# Altium project Pegasus.PrjPcb
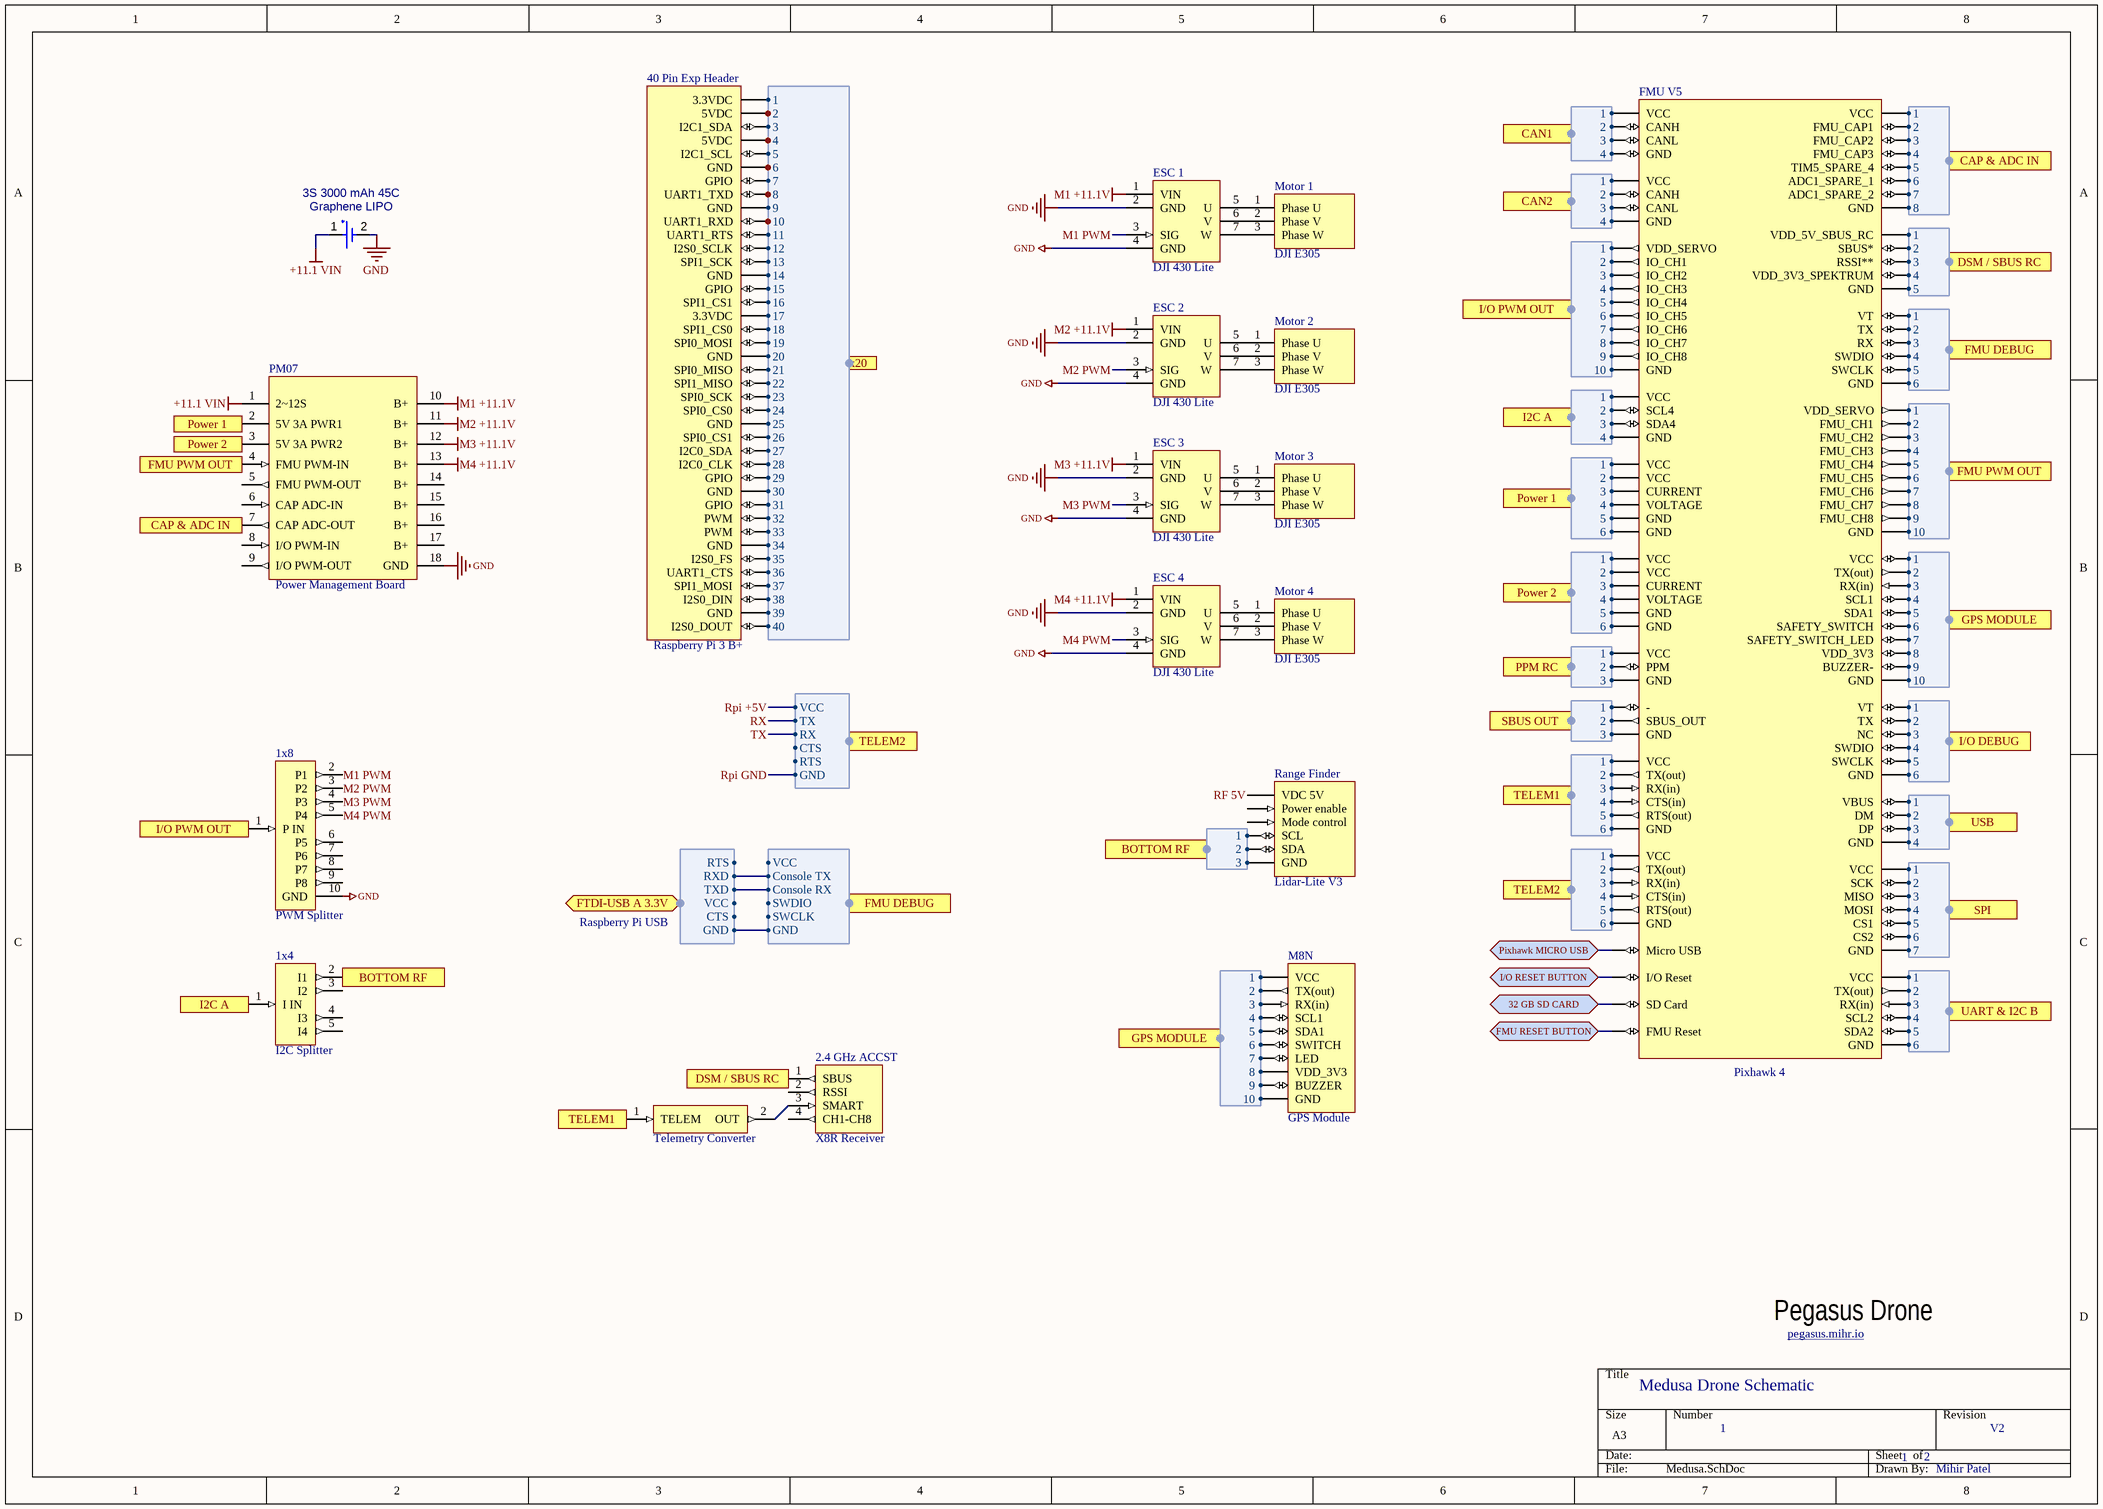
[diagram p0: Medusa.SchDoc]
3 sheets, 78 parts. Net scope: hierarchical (ports join the sheet entries above them; power ports are global).
Sheets:
  Medusa.SchDoc
  Pegasus.SchDoc
    Pegasus PCB = Bellerophon.SchDoc

## Sheet Medusa.SchDoc
size A3; SheetNumber: 1; SheetTotal: 3

### Parts
(Parts that share a designator on the sheet are numbered #1, #2 ... from top to bottom, then left to right.)
1x4#1  I2C Splitter
1x8#1  PWM Splitter
2.4_GHz_ACCST  X8R Receiver
3S_3000_mAh_45C  Graphene LIPO  [SEIK-MS621FE-FL11E-2_V]
40_Pin_Exp_Header  Raspberry Pi 3 B+
ESC_1#1  DJI 430 Lite
ESC_2#1  DJI 430 Lite
ESC_3#1  DJI 430 Lite
ESC_4#1  DJI 430 Lite
FMU_V5#1  Pixhawk 4
M8N#1  GPS Module
Motor_1#1  DJI E305
Motor_2#1  DJI E305
Motor_3#1  DJI E305
Motor_4#1  DJI E305
PM07#1  Power Management Board
Range_Finder  Lidar-Lite V3
TC?  Telemetry Converter

### Ports
2x20 (harness NX), 32 GB SD CARD (bidir), BOTTOM RF (harness *), BOTTOM RF (harness xx), CAN1 (harness CAN1), CAN2 (harness CAN2), CAP & ADC IN (harness CAP & ADC IN), DSM / SBUS RC (harness DSM / SBUS RC), FMU DEBUG (harness FDD), FMU DEBUG (harness FMU DEBUG), FMU PWM OUT (harness FMU PWM OUT), FMU RESET BUTTON (bidir), FTDI-USB A 3.3V (bidir, harness USBD), GPS MODULE (harness GPS MODULE), GPS MODULE (harness GPS), I2C A (harness I2C A), I/O DEBUG (harness IO DEBUG), I/O PWM OUT (harness I/O PWM OUT), I/O RESET BUTTON (bidir), Pixhawk MICRO USB (bidir), Power 1 (harness Power 1), Power 2 (harness Power 2), PPM RC (harness PPM RC), SBUS OUT (harness SBUS OUT), SPI (harness SPI), TELEM1 (harness TELEM1), TELEM2 (harness TELEM2), TELEM2 (harness X1), UART & I2C B (harness UART & I2C B), USB (harness USB)

### Harnesses
CAP & ADC IN: 1, 2, 3, 4, 5, 6, 7, 8
DSM / SBUS RC: 1, 2, 3, 4, 5
FMU DEBUG: 1, 2, 3, 4, 5, 6
FMU PWM OUT: 1, 2, 3, 4, 5, 6, 7, 8, 9, 10
IO DEBUG: 1, 2, 3, 4, 5, 6
SPI: 1, 2, 3, 4, 5, 6, 7
CAN1: 1, 2, 3, 4
CAN2: 1, 2, 3, 4
I/O PWM OUT: 1, 2, 3, 4, 5, 6, 7, 8, 9, 10
I2C A: 1, 2, 3, 4
Power 1: 1, 2, 3, 4, 5, 6
Power 2: 1, 2, 3, 4, 5, 6
SBUS OUT: 1, 2, 3
TELEM1: 1, 2, 3, 4, 5, 6
TELEM2: 1, 2, 3, 4, 5, 6
GPS MODULE: 1, 2, 3, 4, 5, 6, 7, 8, 9, 10
PPM RC: 1, 2, 3
USB: 1, 2, 3, 4
UART & I2C B: 1, 2, 3, 4, 5, 6
GPS: 1, 2, 3, 4, 5, 6, 7, 8, 9, 10
NX: 1, 2, 3, 4, 5, 6, 7, 8, 9, 10, 11, 12, 13, 14, 15, 16, 17, 18, 19, 20, 21, 22, 23, 24, 25, 26, 27, 28, 29, 30, 31, 32, 33, 34, 35, 36, 37, 38, 39, 40
FDD: VCC, Console TX, Console RX, SWDIO, SWCLK, GND
USBD: GND, CTS, VCC, TXD, RXD, RTS
xx: 1, 2, 3
X1: VCC, TX, RX, CTS, RTS, GND

### Nets
+11.1 VIN: 3S_3000_mAh_45C.1(+) PM07#1.1(2~12S)
GND: 1x8#1.10(GND) 3S_3000_mAh_45C.2(-) ESC_1#1.2(GND) ESC_1#1.4(GND) ESC_2#1.2(GND) ESC_2#1.4(GND) ESC_3#1.2(GND) ESC_3#1.4(GND) ESC_4#1.2(GND) ESC_4#1.4(GND) PM07#1.18(GND)
M1 +11.1V: ESC_1#1.1(VIN) PM07#1.10(B+)
M2 +11.1V: ESC_2#1.1(VIN) PM07#1.11(B+)
M3 +11.1V: ESC_3#1.1(VIN) PM07#1.12(B+)
M4 +11.1V: ESC_4#1.1(VIN) PM07#1.13(B+)
M1 PWM: 1x8#1.2(P1) ESC_1#1.3(SIG)
M2 PWM: 1x8#1.3(P2) ESC_2#1.3(SIG)
M3 PWM: 1x8#1.4(P3) ESC_3#1.3(SIG)
M4 PWM: 1x8#1.5(P4) ESC_4#1.3(SIG)
RF 5V: 40_Pin_Exp_Header.2(5VDC) Range_Finder.1(VDC_5V) ; harness NX.2
Rpi +5V: 40_Pin_Exp_Header.4(5VDC) ; harness NX.4, port TELEM2.VCC
Rpi GND: 40_Pin_Exp_Header.6(GND) ; harness NX.6, port TELEM2.GND
RX: 40_Pin_Exp_Header.10(UART1_RXD) ; harness NX.10, port TELEM2.TX
TX: 40_Pin_Exp_Header.8(UART1_TXD) ; harness NX.8, port TELEM2.RX
Net2.4_GHz_ACCST_3: 2.4_GHz_ACCST.3(SMART) TC?.2(OUT)
Net40_Pin_Exp_Header_1: 40_Pin_Exp_Header.1(3.3VDC) ; harness NX.1
Net40_Pin_Exp_Header_3: 40_Pin_Exp_Header.3(I2C1_SDA) ; harness NX.3
Net40_Pin_Exp_Header_5: 40_Pin_Exp_Header.5(I2C1_SCL) ; harness NX.5
Net40_Pin_Exp_Header_7: 40_Pin_Exp_Header.7(GPIO) ; harness NX.7
Net40_Pin_Exp_Header_9: 40_Pin_Exp_Header.9(GND) ; harness NX.9
Net40_Pin_Exp_Header_11: 40_Pin_Exp_Header.11(UART1_RTS) ; harness NX.11
Net40_Pin_Exp_Header_12: 40_Pin_Exp_Header.12(I2S0_SCLK) ; harness NX.12
Net40_Pin_Exp_Header_13: 40_Pin_Exp_Header.13(SPI1_SCK) ; harness NX.13
Net40_Pin_Exp_Header_14: 40_Pin_Exp_Header.14(GND) ; harness NX.14
Net40_Pin_Exp_Header_15: 40_Pin_Exp_Header.15(GPIO) ; harness NX.15
Net40_Pin_Exp_Header_16: 40_Pin_Exp_Header.16(SPI1_CS1) ; harness NX.16
Net40_Pin_Exp_Header_17: 40_Pin_Exp_Header.17(3.3VDC) ; harness NX.17
Net40_Pin_Exp_Header_18: 40_Pin_Exp_Header.18(SPI1_CS0) ; harness NX.18
Net40_Pin_Exp_Header_19: 40_Pin_Exp_Header.19(SPI0_MOSI) ; harness NX.19
Net40_Pin_Exp_Header_20: 40_Pin_Exp_Header.20(GND) ; harness NX.20
Net40_Pin_Exp_Header_21: 40_Pin_Exp_Header.21(SPI0_MISO) ; harness NX.21
Net40_Pin_Exp_Header_22: 40_Pin_Exp_Header.22(SPI1_MISO) ; harness NX.22
Net40_Pin_Exp_Header_23: 40_Pin_Exp_Header.23(SPI0_SCK) ; harness NX.23
Net40_Pin_Exp_Header_24: 40_Pin_Exp_Header.24(SPI0_CS0) ; harness NX.24
Net40_Pin_Exp_Header_25: 40_Pin_Exp_Header.25(GND) ; harness NX.25
Net40_Pin_Exp_Header_26: 40_Pin_Exp_Header.26(SPI0_CS1) ; harness NX.26
Net40_Pin_Exp_Header_27: 40_Pin_Exp_Header.27(I2C0_SDA) ; harness NX.27
Net40_Pin_Exp_Header_28: 40_Pin_Exp_Header.28(I2C0_CLK) ; harness NX.28
Net40_Pin_Exp_Header_29: 40_Pin_Exp_Header.29(GPIO) ; harness NX.29
Net40_Pin_Exp_Header_30: 40_Pin_Exp_Header.30(GND) ; harness NX.30
Net40_Pin_Exp_Header_31: 40_Pin_Exp_Header.31(GPIO) ; harness NX.31
Net40_Pin_Exp_Header_32: 40_Pin_Exp_Header.32(PWM) ; harness NX.32
Net40_Pin_Exp_Header_33: 40_Pin_Exp_Header.33(PWM) ; harness NX.33
Net40_Pin_Exp_Header_34: 40_Pin_Exp_Header.34(GND) ; harness NX.34
Net40_Pin_Exp_Header_35: 40_Pin_Exp_Header.35(I2S0_FS) ; harness NX.35
Net40_Pin_Exp_Header_36: 40_Pin_Exp_Header.36(UART1_CTS) ; harness NX.36
Net40_Pin_Exp_Header_37: 40_Pin_Exp_Header.37(SPI1_MOSI) ; harness NX.37
Net40_Pin_Exp_Header_38: 40_Pin_Exp_Header.38(I2S0_DIN) ; harness NX.38
Net40_Pin_Exp_Header_39: 40_Pin_Exp_Header.39(GND) ; harness NX.39
Net40_Pin_Exp_Header_40: 40_Pin_Exp_Header.40(I2S0_DOUT) ; harness NX.40
NetESC_1#1_5: ESC_1#1.5(U) Motor_1#1.1(Phase_U)
NetESC_1#1_6: ESC_1#1.6(V) Motor_1#1.2(Phase_V)
NetESC_1#1_7: ESC_1#1.7(W) Motor_1#1.3(Phase_W)
NetESC_2#1_5: ESC_2#1.5(U) Motor_2#1.1(Phase_U)
NetESC_2#1_6: ESC_2#1.6(V) Motor_2#1.2(Phase_V)
NetESC_2#1_7: ESC_2#1.7(W) Motor_2#1.3(Phase_W)
NetESC_3#1_5: ESC_3#1.5(U) Motor_3#1.1(Phase_U)
NetESC_3#1_6: ESC_3#1.6(V) Motor_3#1.2(Phase_V)
NetESC_3#1_7: ESC_3#1.7(W) Motor_3#1.3(Phase_W)
NetESC_4#1_5: ESC_4#1.5(U) Motor_4#1.1(Phase_U)
NetESC_4#1_6: ESC_4#1.6(V) Motor_4#1.2(Phase_V)
NetESC_4#1_7: ESC_4#1.7(W) Motor_4#1.3(Phase_W)
NetFMU_V5#1_1: FMU_V5#1.1(VCC) ; port Power 1.1
NetFMU_V5#1_2: FMU_V5#1.2(VCC) ; port Power 1.2
NetFMU_V5#1_3: FMU_V5#1.3(CURRENT) ; port Power 1.3
NetFMU_V5#1_4: FMU_V5#1.4(VOLTAGE) ; port Power 1.4
NetFMU_V5#1_5: FMU_V5#1.5(GND) ; port Power 1.5
NetFMU_V5#1_6: FMU_V5#1.6(GND) ; port Power 1.6
NetFMU_V5#1_7: FMU_V5#1.7(VCC) ; port Power 2.1
NetFMU_V5#1_8: FMU_V5#1.8(VCC) ; port Power 2.2
NetFMU_V5#1_9: FMU_V5#1.9(CURRENT) ; port Power 2.3
NetFMU_V5#1_10: FMU_V5#1.10(VOLTAGE) ; port Power 2.4
NetFMU_V5#1_11: FMU_V5#1.11(GND) ; port Power 2.5
NetFMU_V5#1_12: FMU_V5#1.12(GND) ; port Power 2.6
NetFMU_V5#1_13: FMU_V5#1.13(VCC) ; port TELEM1.1
NetFMU_V5#1_14: FMU_V5#1.14(TX(out)) ; port TELEM1.2
NetFMU_V5#1_15: FMU_V5#1.15(RX(in)) ; port TELEM1.3
NetFMU_V5#1_16: FMU_V5#1.16(CTS(in)) ; port TELEM1.4
NetFMU_V5#1_17: FMU_V5#1.17(RTS(out)) ; port TELEM1.5
NetFMU_V5#1_18: FMU_V5#1.18(GND) ; port TELEM1.6
NetFMU_V5#1_19: FMU_V5#1.19(VBUS) ; port USB.1
NetFMU_V5#1_20: FMU_V5#1.20(DM) ; port USB.2
NetFMU_V5#1_21: FMU_V5#1.21(DP) ; port USB.3
NetFMU_V5#1_22: FMU_V5#1.22(GND) ; port USB.4
NetFMU_V5#1_23: FMU_V5#1.23(VCC) ; port TELEM2.1
NetFMU_V5#1_24: FMU_V5#1.24(TX(out)) ; port TELEM2.2
NetFMU_V5#1_25: FMU_V5#1.25(RX(in)) ; port TELEM2.3
NetFMU_V5#1_26: FMU_V5#1.26(CTS(in)) ; port TELEM2.4
NetFMU_V5#1_27: FMU_V5#1.27(RTS(out)) ; port TELEM2.5
NetFMU_V5#1_28: FMU_V5#1.28(GND) ; port TELEM2.6
NetFMU_V5#1_29: FMU_V5#1.29(VCC) ; port CAN1.1
NetFMU_V5#1_30: FMU_V5#1.30(CANH) ; port CAN1.2
NetFMU_V5#1_31: FMU_V5#1.31(CANL) ; port CAN1.3
NetFMU_V5#1_32: FMU_V5#1.32(GND) ; port CAN1.4
NetFMU_V5#1_33: FMU_V5#1.33(VCC) ; port I2C A.1
NetFMU_V5#1_34: FMU_V5#1.34(SCL4) ; port I2C A.2
NetFMU_V5#1_35: FMU_V5#1.35(SDA4) ; port I2C A.3
NetFMU_V5#1_36: FMU_V5#1.36(GND) ; port I2C A.4
NetFMU_V5#1_37: FMU_V5#1.37(VCC) ; port CAN2.1
NetFMU_V5#1_38: FMU_V5#1.38(CANH) ; port CAN2.2
NetFMU_V5#1_39: FMU_V5#1.39(CANL) ; port CAN2.3
NetFMU_V5#1_40: FMU_V5#1.40(GND) ; port CAN2.4
NetFMU_V5#1_41: FMU_V5#1.41(-) ; port SBUS OUT.1
NetFMU_V5#1_42: FMU_V5#1.42(SBUS_OUT) ; port SBUS OUT.2
NetFMU_V5#1_43: FMU_V5#1.43(GND) ; port SBUS OUT.3
NetFMU_V5#1_44: FMU_V5#1.44(VCC) ; port PPM RC.1
NetFMU_V5#1_45: FMU_V5#1.45(PPM) ; port PPM RC.2
NetFMU_V5#1_46: FMU_V5#1.46(GND) ; port PPM RC.3
NetFMU_V5#1_47: FMU_V5#1.47(VDD_SERVO) ; port I/O PWM OUT.1
NetFMU_V5#1_48: FMU_V5#1.48(IO_CH1) ; port I/O PWM OUT.2
NetFMU_V5#1_49: FMU_V5#1.49(IO_CH2) ; port I/O PWM OUT.3
NetFMU_V5#1_50: FMU_V5#1.50(IO_CH3) ; port I/O PWM OUT.4
NetFMU_V5#1_51: FMU_V5#1.51(IO_CH4) ; port I/O PWM OUT.5
NetFMU_V5#1_52: FMU_V5#1.52(IO_CH5) ; port I/O PWM OUT.6
NetFMU_V5#1_53: FMU_V5#1.53(IO_CH6) ; port I/O PWM OUT.7
NetFMU_V5#1_54: FMU_V5#1.54(IO_CH7) ; port I/O PWM OUT.8
NetFMU_V5#1_55: FMU_V5#1.55(IO_CH8) ; port I/O PWM OUT.9
NetFMU_V5#1_56: FMU_V5#1.56(GND) ; port I/O PWM OUT.10
NetFMU_V5#1_57: FMU_V5#1.57(VCC) ; port UART & I2C B.1
NetFMU_V5#1_58: FMU_V5#1.58(TX(out)) ; port UART & I2C B.2
NetFMU_V5#1_59: FMU_V5#1.59(RX(in)) ; port UART & I2C B.3
NetFMU_V5#1_60: FMU_V5#1.60(SCL2) ; port UART & I2C B.4
NetFMU_V5#1_61: FMU_V5#1.61(SDA2) ; port UART & I2C B.5
NetFMU_V5#1_62: FMU_V5#1.62(GND) ; port UART & I2C B.6
NetFMU_V5#1_63: FMU_V5#1.63(VDD_5V_SBUS_RC) ; port DSM / SBUS RC.1
NetFMU_V5#1_64: FMU_V5#1.64(SBUS*) ; port DSM / SBUS RC.2
NetFMU_V5#1_65: FMU_V5#1.65(RSSI**) ; port DSM / SBUS RC.3
NetFMU_V5#1_66: FMU_V5#1.66(VDD_3V3_SPEKTRUM) ; port DSM / SBUS RC.4
NetFMU_V5#1_67: FMU_V5#1.67(GND) ; port DSM / SBUS RC.5
NetFMU_V5#1_68: FMU_V5#1.68(VCC) ; port CAP & ADC IN.1
NetFMU_V5#1_69: FMU_V5#1.69(FMU_CAP1) ; port CAP & ADC IN.2
NetFMU_V5#1_70: FMU_V5#1.70(FMU_CAP2) ; port CAP & ADC IN.3
NetFMU_V5#1_71: FMU_V5#1.71(FMU_CAP3) ; port CAP & ADC IN.4
NetFMU_V5#1_72: FMU_V5#1.72(TIM5_SPARE_4) ; port CAP & ADC IN.5
NetFMU_V5#1_73: FMU_V5#1.73(ADC1_SPARE_1) ; port CAP & ADC IN.6
NetFMU_V5#1_74: FMU_V5#1.74(ADC1_SPARE_2) ; port CAP & ADC IN.7
NetFMU_V5#1_75: FMU_V5#1.75(GND) ; port CAP & ADC IN.8
NetFMU_V5#1_76: FMU_V5#1.76(VCC) M8N#1.1(VCC) ; port GPS MODULE.1
NetFMU_V5#1_77: FMU_V5#1.77(TX(out)) M8N#1.2(TX(out)) ; port GPS MODULE.2
NetFMU_V5#1_78: FMU_V5#1.78(RX(in)) M8N#1.3(RX(in)) ; port GPS MODULE.3
NetFMU_V5#1_79: FMU_V5#1.79(SCL1) M8N#1.4(SCL1) ; port GPS MODULE.4
NetFMU_V5#1_80: FMU_V5#1.80(SDA1) M8N#1.5(SDA1) ; port GPS MODULE.5
NetFMU_V5#1_81: FMU_V5#1.81(SAFETY_SWITCH) M8N#1.6(SWITCH) ; port GPS MODULE.6
NetFMU_V5#1_82: FMU_V5#1.82(SAFETY_SWITCH_LED) M8N#1.7(LED) ; port GPS MODULE.7
NetFMU_V5#1_83: FMU_V5#1.83(VDD_3V3) M8N#1.8(VDD_3V3) ; port GPS MODULE.8
NetFMU_V5#1_84: FMU_V5#1.84(BUZZER-) M8N#1.9(BUZZER) ; port GPS MODULE.9
NetFMU_V5#1_85: FMU_V5#1.85(GND) M8N#1.10(GND) ; port GPS MODULE.10
NetFMU_V5#1_86: FMU_V5#1.86(VCC) ; port SPI.1
NetFMU_V5#1_87: FMU_V5#1.87(SCK) ; port SPI.2
NetFMU_V5#1_88: FMU_V5#1.88(MISO) ; port SPI.3
NetFMU_V5#1_89: FMU_V5#1.89(MOSI) ; port SPI.4
NetFMU_V5#1_90: FMU_V5#1.90(CS1) ; port SPI.5
NetFMU_V5#1_91: FMU_V5#1.91(CS2) ; port SPI.6
NetFMU_V5#1_92: FMU_V5#1.92(GND) ; port SPI.7
NetFMU_V5#1_93: FMU_V5#1.93(VDD_SERVO) ; port FMU PWM OUT.1
NetFMU_V5#1_94: FMU_V5#1.94(FMU_CH1) ; port FMU PWM OUT.2
NetFMU_V5#1_95: FMU_V5#1.95(FMU_CH2) ; port FMU PWM OUT.3
NetFMU_V5#1_96: FMU_V5#1.96(FMU_CH3) ; port FMU PWM OUT.4
NetFMU_V5#1_97: FMU_V5#1.97(FMU_CH4) ; port FMU PWM OUT.5
NetFMU_V5#1_98: FMU_V5#1.98(FMU_CH5) ; port FMU PWM OUT.6
NetFMU_V5#1_99: FMU_V5#1.99(FMU_CH6) ; port FMU PWM OUT.7
NetFMU_V5#1_100: FMU_V5#1.100(FMU_CH7) ; port FMU PWM OUT.8
NetFMU_V5#1_101: FMU_V5#1.101(FMU_CH8) ; port FMU PWM OUT.9
NetFMU_V5#1_102: FMU_V5#1.102(GND) ; port FMU PWM OUT.10
NetFMU_V5#1_103: FMU_V5#1.103(VT) ; port FMU DEBUG.1
NetFMU_V5#1_104: FMU_V5#1.104(TX) ; port FMU DEBUG.2
NetFMU_V5#1_105: FMU_V5#1.105(RX) ; port FMU DEBUG.3
NetFMU_V5#1_106: FMU_V5#1.106(SWDIO) ; port FMU DEBUG.4
NetFMU_V5#1_107: FMU_V5#1.107(SWCLK) ; port FMU DEBUG.5
NetFMU_V5#1_108: FMU_V5#1.108(GND) ; port FMU DEBUG.6
NetFMU_V5#1_109: FMU_V5#1.109(VT) ; port I/O DEBUG.1
NetFMU_V5#1_110: FMU_V5#1.110(TX) ; port I/O DEBUG.2
NetFMU_V5#1_111: FMU_V5#1.111(NC) ; port I/O DEBUG.3
NetFMU_V5#1_112: FMU_V5#1.112(SWDIO) ; port I/O DEBUG.4
NetFMU_V5#1_113: FMU_V5#1.113(SWCLK) ; port I/O DEBUG.5
NetFMU_V5#1_114: FMU_V5#1.114(GND) ; port I/O DEBUG.6
NetFMU_V5#1_115: FMU_V5#1.115(Micro_USB) ; port Pixhawk MICRO USB
NetFMU_V5#1_116: FMU_V5#1.116(I/O_Reset) ; port I/O RESET BUTTON
NetFMU_V5#1_117: FMU_V5#1.117(SD_Card) ; port 32 GB SD CARD
NetFMU_V5#1_118: FMU_V5#1.118(FMU_Reset) ; port FMU RESET BUTTON
NetRange_Finder_4: Range_Finder.4(SCL) ; port BOTTOM RF.1
NetRange_Finder_5: Range_Finder.5(SDA) ; port BOTTOM RF.2
NetRange_Finder_6: Range_Finder.6(GND) ; port BOTTOM RF.3
(unnamed): port FMU DEBUG.Console TX, port FTDI-USB A 3.3V.RXD
(unnamed): port FMU DEBUG.Console RX, port FTDI-USB A 3.3V.TXD
(unnamed): port FMU DEBUG.GND, port FTDI-USB A 3.3V.GND

Not connected (* = marked no-connect by the designer): 1x4#1 1(I_IN) 2(I1) 3(I2) 4(I3) 5(I4); 1x8#1 1(P_IN) 6(P5) 7(P6) 8(P7) 9(P8); 2.4_GHz_ACCST 1(SBUS) 2(RSSI) 4(CH1-CH8); PM07#1 2(5V_3A_PWR1) 3(5V_3A_PWR2) 4(FMU_PWM-IN) 5(FMU_PWM-OUT) 6(CAP_ADC-IN) 7(CAP_ADC-OUT) 8(I/O_PWM-IN) 9(I/O_PWM-OUT) 14(B+) 15(B+) 16(B+) 17(B+); Range_Finder 2(Power_enable) 3(Mode_control); TC? 1(TELEM)

### Notes on the sheet
- Raspberry Pi USB
- Pegasus Drone
- Medusa Drone Schematic
- pegasus.mihr.io <http://pegasus.mihr.io>
- 1
- 2
- V2
- Mihir Patel

### Library data of the parts
1x4#1 = CMP-00028-00024-3: Holybro I2C Splitter
1x8#1 = CMP-00028-00022-4: Holybro PWM Splitter
2.4_GHz_ACCST = CMP-00028-00023-1: FrSky 2.4GHz ACCST
3S_3000_mAh_45C = CMP-00029-00000-1: MS Lihium Rechargeable Battery, 3 V, -20 to 60 degC, Tray; RoHS Compliant: NotApplicable; Mounting Technology: WithLeads; Pins: 2
40_Pin_Exp_Header = CMP-00028-00030-3: 40 Pin Exp Header
ESC_1#1 ESC_2#1 ESC_3#1 ESC_4#1 = CMP-00028-00016-7: T-Motor ESC 600 Hz
FMU_V5#1 = CMP-00028-00018-8: FMU V5
M8N#1 = CMP-00028-00021-1: Pixhawk 4 GPS Module
Motor_1#1 Motor_2#1 Motor_3#1 Motor_4#1 = CMP-00028-00017-4: KV400
PM07#1 = CMP-00028-00007-5: Holybro Power Module
Range_Finder = CMP-00028-00011-7: Garmin Lidar
TC? = CMP-00028-00026-1: FrSky Yappu Telemetry Converter Cable

## Sheet Pegasus.SchDoc
size Tabloid; SheetNumber: 2; SheetTotal: 3
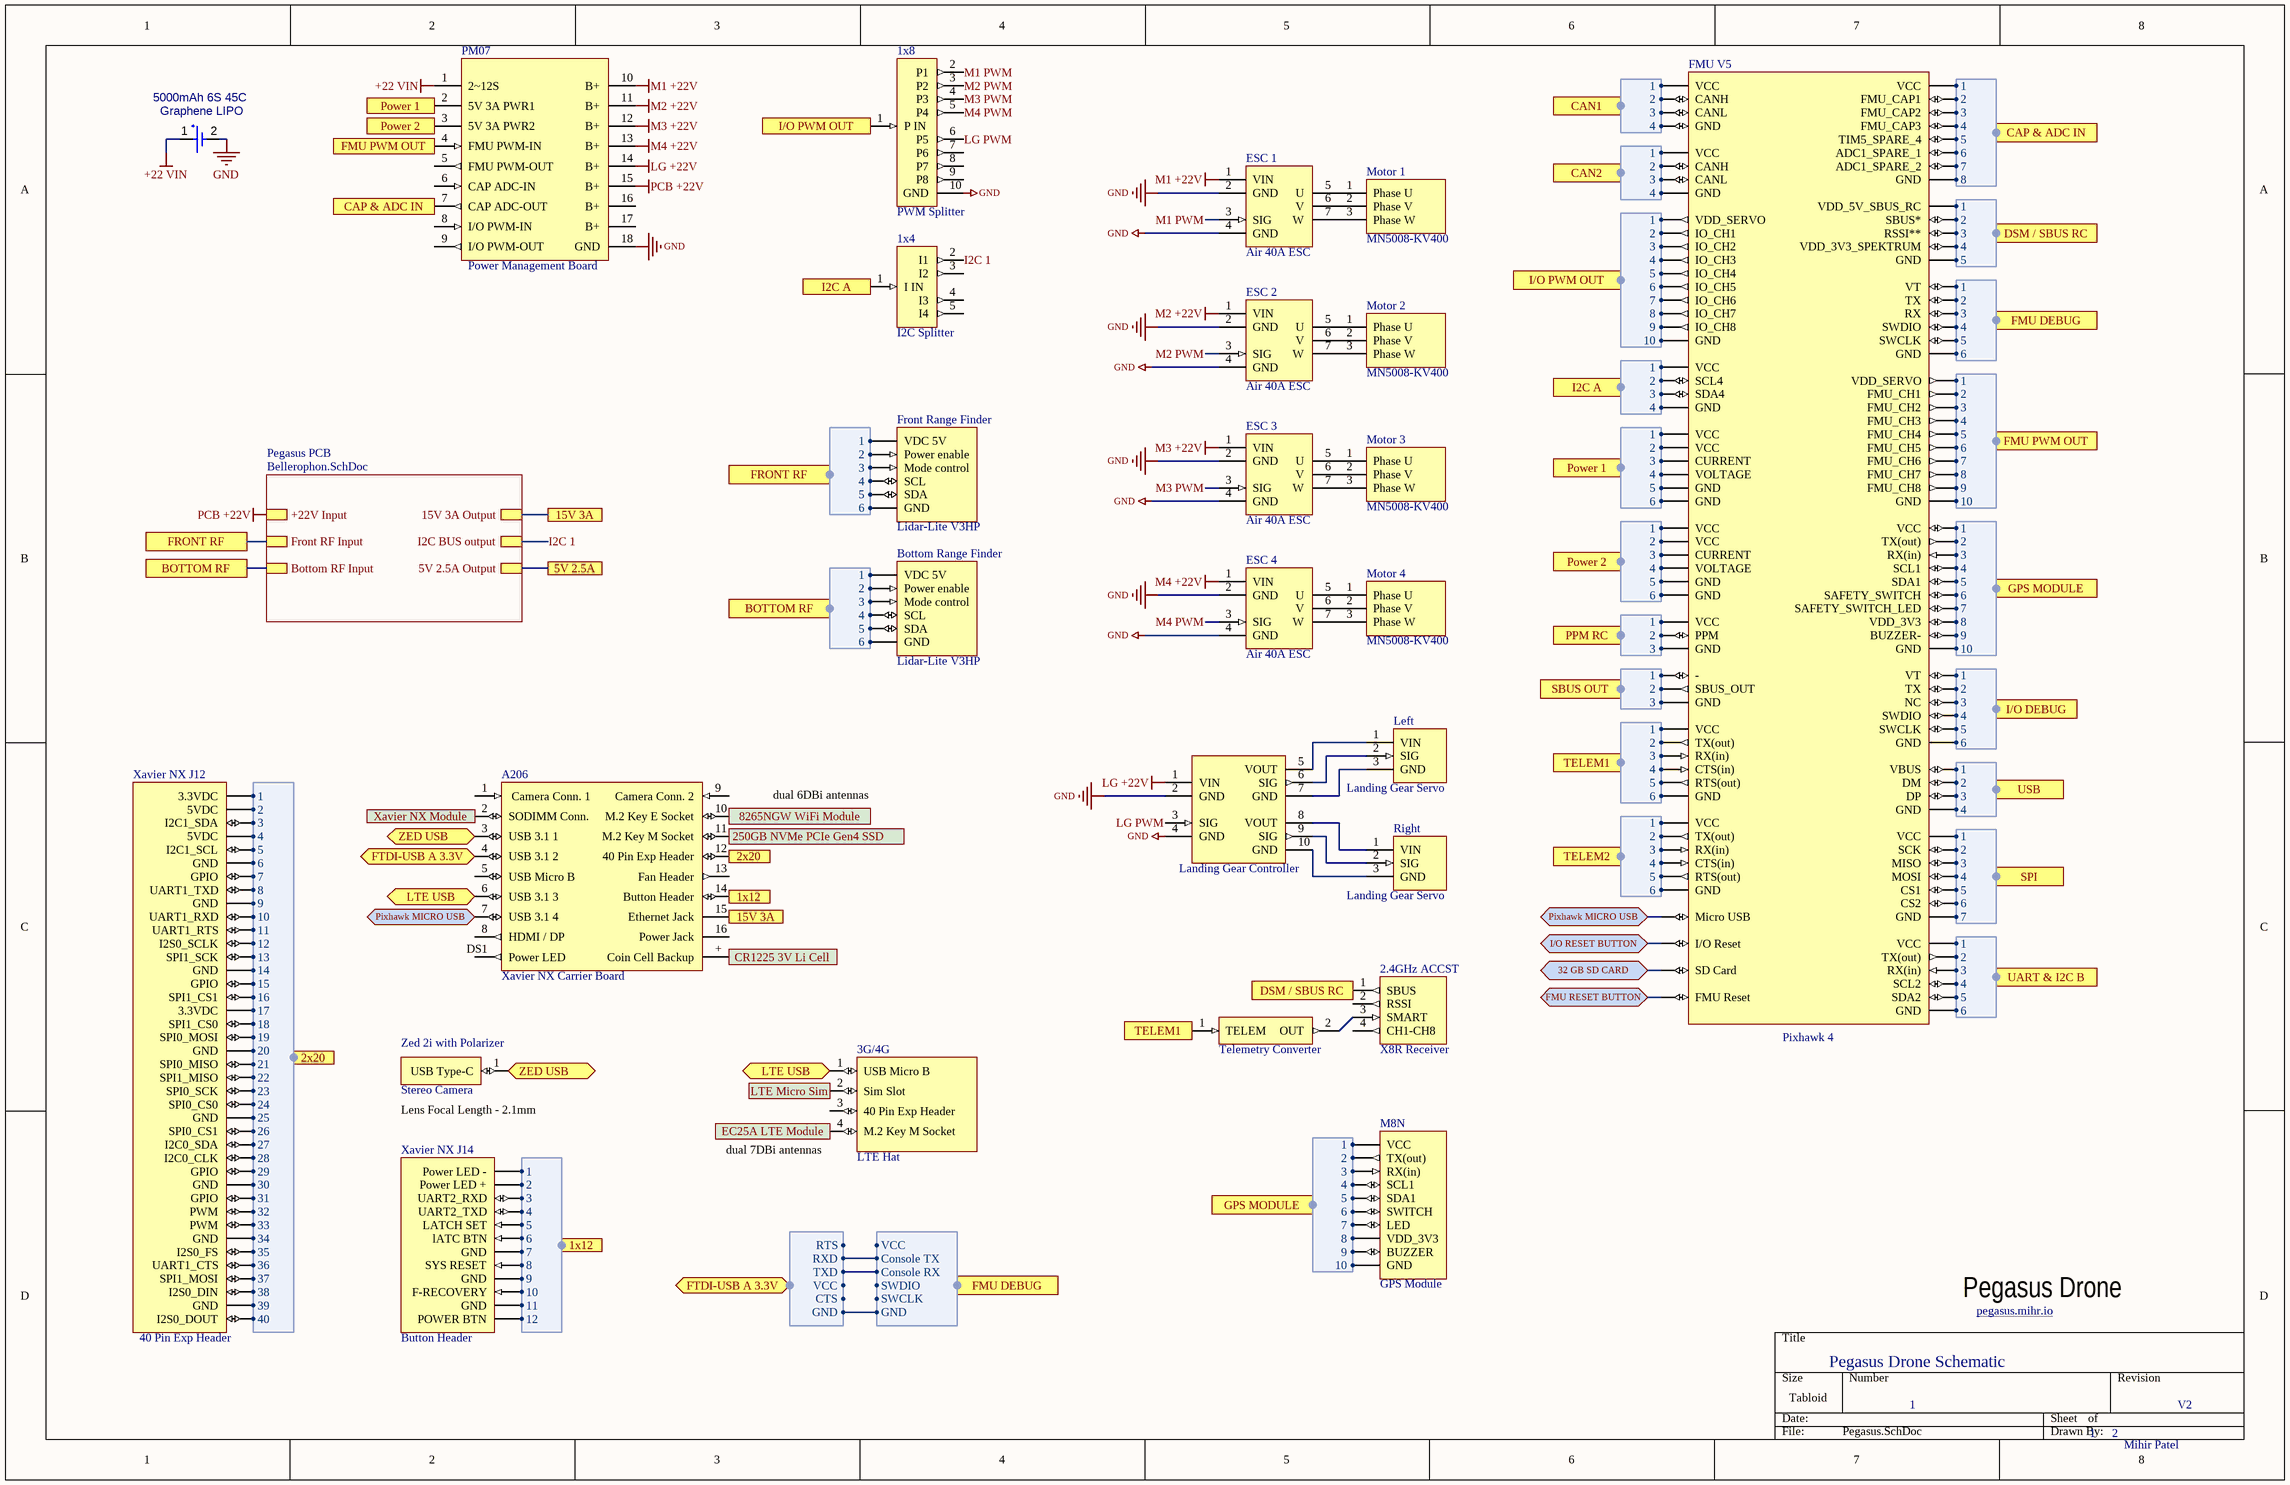
[diagram p1: Pegasus.SchDoc]

### Parts
(Parts that share a designator on the sheet are numbered #1, #2 ... from top to bottom, then left to right.)
1x4#2  I2C Splitter
1x8#2  PWM Splitter
2.4GHz_ACCST  X8R Receiver
3G/4G  LTE Hat
5000mAh_6S_45C  Graphene LIPO  [SEIK-MS621FE-FL11E-2_V]
A206  Xavier NX Carrier Board
Bottom_Range_Finder  Lidar-Lite V3HP
ESC_1#2  Air 40A ESC
ESC_2#2  Air 40A ESC
ESC_3#2  Air 40A ESC
ESC_4#2  Air 40A ESC
FMU_V5#2  Pixhawk 4
Front_Range_Finder  Lidar-Lite V3HP
Left  Landing Gear Servo
LGC  Landing Gear Controller
M8N#2  GPS Module
Motor_1#2  MN5008-KV400
Motor_2#2  MN5008-KV400
Motor_3#2  MN5008-KV400
Motor_4#2  MN5008-KV400
PM07#2  Power Management Board
Right  Landing Gear Servo
TC1  Telemetry Converter
Xavier_NX_J12  40 Pin Exp Header
Xavier_NX_J14  Button Header
Zed_2i_with_Polarizer  Stereo Camera

### Sub-sheets
Pegasus PCB = Bellerophon.SchDoc: 15V 3A Output, +22V Input, Front RF Input, Bottom RF Input, I2C BUS output, 5V 2.5A Output

### Ports
1x12 (harness 1x12), 1x12 (harness *), 2x20 (harness NX), 5V 2.5A, 15V 3A, 32 GB SD CARD (bidir), 250GB NVMe PCIe Gen4 SSD, 8265NGW WiFi Module, BOTTOM RF (harness L2), CAN1 (harness CAN1), CAN2 (harness CAN2), CAP & ADC IN (harness CAP & ADC IN), CR1225 3V Li Cell, DSM / SBUS RC (harness DSM / SBUS RC), EC25A LTE Module, FMU DEBUG (harness FDD), FMU DEBUG (harness FMU DEBUG), FMU PWM OUT (harness FMU PWM OUT), FMU RESET BUTTON (bidir), FRONT RF (harness L1), FTDI-USB A 3.3V (bidir, harness USBD), GPS MODULE (harness GPS MODULE), GPS MODULE (harness GPS), I2C A (harness I2C A), I/O DEBUG (harness IO DEBUG), I/O PWM OUT (harness I/O PWM OUT), I/O RESET BUTTON (bidir), LTE Micro Sim, LTE USB (bidir), Pixhawk MICRO USB (bidir), Power 1 (harness Power 1), Power 2 (harness Power 2), PPM RC (harness PPM RC), SBUS OUT (harness SBUS OUT), SPI (harness SPI), TELEM1 (harness TELEM1), TELEM2 (harness TELEM2), UART & I2C B (harness UART & I2C B), USB (harness USB), Xavier NX Module, ZED USB (bidir)

### Harnesses
CAP & ADC IN: 1, 2, 3, 4, 5, 6, 7, 8
DSM / SBUS RC: 1, 2, 3, 4, 5
FMU DEBUG: 1, 2, 3, 4, 5, 6
FMU PWM OUT: 1, 2, 3, 4, 5, 6, 7, 8, 9, 10
IO DEBUG: 1, 2, 3, 4, 5, 6
SPI: 1, 2, 3, 4, 5, 6, 7
CAN1: 1, 2, 3, 4
CAN2: 1, 2, 3, 4
I/O PWM OUT: 1, 2, 3, 4, 5, 6, 7, 8, 9, 10
I2C A: 1, 2, 3, 4
Power 1: 1, 2, 3, 4, 5, 6
Power 2: 1, 2, 3, 4, 5, 6
SBUS OUT: 1, 2, 3
TELEM1: 1, 2, 3, 4, 5, 6
TELEM2: 1, 2, 3, 4, 5, 6
GPS MODULE: 1, 2, 3, 4, 5, 6, 7, 8, 9, 10
PPM RC: 1, 2, 3
USB: 1, 2, 3, 4
UART & I2C B: 1, 2, 3, 4, 5, 6
L1: 1, 2, 3, 4, 5, 6
L2: 1, 2, 3, 4, 5, 6
GPS: 1, 2, 3, 4, 5, 6, 7, 8, 9, 10
NX: 1, 2, 3, 4, 5, 6, 7, 8, 9, 10, 11, 12, 13, 14, 15, 16, 17, 18, 19, 20, 21, 22, 23, 24, 25, 26, 27, 28, 29, 30, 31, 32, 33, 34, 35, 36, 37, 38, 39, 40
1x12: 1, 2, 3, 4, 5, 6, 7, 8, 9, 10, 11, 12
FDD: VCC, Console TX, Console RX, SWDIO, SWCLK, GND
USBD: GND, CTS, VCC, TXD, RXD, RTS

### Nets
+22 VIN: 5000mAh_6S_45C.1(+) PM07#2.1(2~12S)
GND: 1x8#2.10(GND) 5000mAh_6S_45C.2(-) ESC_1#2.2(GND) ESC_1#2.4(GND) ESC_2#2.2(GND) ESC_2#2.4(GND) ESC_3#2.2(GND) ESC_3#2.4(GND) ESC_4#2.2(GND) ESC_4#2.4(GND) LGC.2(GND) LGC.4(GND) PM07#2.18(GND)
LG +22V: LGC.1(VIN) PM07#2.14(B+)
M1 +22V: ESC_1#2.1(VIN) PM07#2.10(B+)
M2 +22V: ESC_2#2.1(VIN) PM07#2.11(B+)
M3 +22V: ESC_3#2.1(VIN) PM07#2.12(B+)
M4 +22V: ESC_4#2.1(VIN) PM07#2.13(B+)
PCB +22V: PM07#2.15(B+) ; sheet Pegasus PCB/+22V Input
I2C 1: 1x4#2.2(I1) ; sheet Pegasus PCB/I2C BUS output
LG PWM: 1x8#2.6(P5) LGC.3(SIG)
M1 PWM: 1x8#2.2(P1) ESC_1#2.3(SIG)
M2 PWM: 1x8#2.3(P2) ESC_2#2.3(SIG)
M3 PWM: 1x8#2.4(P3) ESC_3#2.3(SIG)
M4 PWM: 1x8#2.5(P4) ESC_4#2.3(SIG)
Net2.4GHz_ACCST_3: 2.4GHz_ACCST.3(SMART) TC1.2(OUT)
Net3G/4G_1: 3G/4G.1(USB_Micro_B) A206.6(USB_3.1_3) ; port LTE USB
Net3G/4G_2: 3G/4G.2(Sim_Slot) ; port LTE Micro Sim
Net3G/4G_4: 3G/4G.4(M.2_Key_M_Socket) ; port EC25A LTE Module
NetA206_2: A206.2(SODIMM_Conn.) ; port Xavier NX Module
NetA206_3: A206.3(USB_3.1_1) Zed_2i_with_Polarizer.1(USB_Type-C) ; port ZED USB
NetA206_7: A206.7(USB_3.1_4) FMU_V5#2.115(Micro_USB) ; port Pixhawk MICRO USB
NetA206_10: A206.10(M.2_Key_E_Socket) ; port 8265NGW WiFi Module
NetA206_11: A206.11(M.2_Key_M_Socket) ; port 250GB NVMe PCIe Gen4 SSD
NetA206_15: A206.15(Ethernet_Jack) ; port 15V 3A, sheet Pegasus PCB/15V 3A Output
NetA206_+: A206.+(Coin_Cell_Backup) ; port CR1225 3V Li Cell
NetBottom_Range_Finder_1: Bottom_Range_Finder.1(VDC_5V) ; port BOTTOM RF.1
NetBottom_Range_Finder_2: Bottom_Range_Finder.2(Power_enable) ; port BOTTOM RF.2
NetBottom_Range_Finder_3: Bottom_Range_Finder.3(Mode_control) ; port BOTTOM RF.3
NetBottom_Range_Finder_4: Bottom_Range_Finder.4(SCL) ; port BOTTOM RF.4
NetBottom_Range_Finder_5: Bottom_Range_Finder.5(SDA) ; port BOTTOM RF.5
NetBottom_Range_Finder_6: Bottom_Range_Finder.6(GND) ; port BOTTOM RF.6
NetESC_1#2_5: ESC_1#2.5(U) Motor_1#2.1(Phase_U)
NetESC_1#2_6: ESC_1#2.6(V) Motor_1#2.2(Phase_V)
NetESC_1#2_7: ESC_1#2.7(W) Motor_1#2.3(Phase_W)
NetESC_2#2_5: ESC_2#2.5(U) Motor_2#2.1(Phase_U)
NetESC_2#2_6: ESC_2#2.6(V) Motor_2#2.2(Phase_V)
NetESC_2#2_7: ESC_2#2.7(W) Motor_2#2.3(Phase_W)
NetESC_3#2_5: ESC_3#2.5(U) Motor_3#2.1(Phase_U)
NetESC_3#2_6: ESC_3#2.6(V) Motor_3#2.2(Phase_V)
NetESC_3#2_7: ESC_3#2.7(W) Motor_3#2.3(Phase_W)
NetESC_4#2_5: ESC_4#2.5(U) Motor_4#2.1(Phase_U)
NetESC_4#2_6: ESC_4#2.6(V) Motor_4#2.2(Phase_V)
NetESC_4#2_7: ESC_4#2.7(W) Motor_4#2.3(Phase_W)
NetFMU_V5#2_1: FMU_V5#2.1(VCC) ; port Power 1.1
NetFMU_V5#2_2: FMU_V5#2.2(VCC) ; port Power 1.2
NetFMU_V5#2_3: FMU_V5#2.3(CURRENT) ; port Power 1.3
NetFMU_V5#2_4: FMU_V5#2.4(VOLTAGE) ; port Power 1.4
NetFMU_V5#2_5: FMU_V5#2.5(GND) ; port Power 1.5
NetFMU_V5#2_6: FMU_V5#2.6(GND) ; port Power 1.6
NetFMU_V5#2_7: FMU_V5#2.7(VCC) ; port Power 2.1
NetFMU_V5#2_8: FMU_V5#2.8(VCC) ; port Power 2.2
NetFMU_V5#2_9: FMU_V5#2.9(CURRENT) ; port Power 2.3
NetFMU_V5#2_10: FMU_V5#2.10(VOLTAGE) ; port Power 2.4
NetFMU_V5#2_11: FMU_V5#2.11(GND) ; port Power 2.5
NetFMU_V5#2_12: FMU_V5#2.12(GND) ; port Power 2.6
NetFMU_V5#2_13: FMU_V5#2.13(VCC) ; port TELEM1.1
NetFMU_V5#2_14: FMU_V5#2.14(TX(out)) ; port TELEM1.2
NetFMU_V5#2_15: FMU_V5#2.15(RX(in)) ; port TELEM1.3
NetFMU_V5#2_16: FMU_V5#2.16(CTS(in)) ; port TELEM1.4
NetFMU_V5#2_17: FMU_V5#2.17(RTS(out)) ; port TELEM1.5
NetFMU_V5#2_18: FMU_V5#2.18(GND) ; port TELEM1.6
NetFMU_V5#2_19: FMU_V5#2.19(VBUS) ; port USB.1
NetFMU_V5#2_20: FMU_V5#2.20(DM) ; port USB.2
NetFMU_V5#2_21: FMU_V5#2.21(DP) ; port USB.3
NetFMU_V5#2_22: FMU_V5#2.22(GND) ; port USB.4
NetFMU_V5#2_23: FMU_V5#2.23(VCC) ; port TELEM2.1
NetFMU_V5#2_24: FMU_V5#2.24(TX(out)) ; port TELEM2.2
NetFMU_V5#2_25: FMU_V5#2.25(RX(in)) ; port TELEM2.3
NetFMU_V5#2_26: FMU_V5#2.26(CTS(in)) ; port TELEM2.4
NetFMU_V5#2_27: FMU_V5#2.27(RTS(out)) ; port TELEM2.5
NetFMU_V5#2_28: FMU_V5#2.28(GND) ; port TELEM2.6
NetFMU_V5#2_29: FMU_V5#2.29(VCC) ; port CAN1.1
NetFMU_V5#2_30: FMU_V5#2.30(CANH) ; port CAN1.2
NetFMU_V5#2_31: FMU_V5#2.31(CANL) ; port CAN1.3
NetFMU_V5#2_32: FMU_V5#2.32(GND) ; port CAN1.4
NetFMU_V5#2_33: FMU_V5#2.33(VCC) ; port I2C A.1
NetFMU_V5#2_34: FMU_V5#2.34(SCL4) ; port I2C A.2
NetFMU_V5#2_35: FMU_V5#2.35(SDA4) ; port I2C A.3
NetFMU_V5#2_36: FMU_V5#2.36(GND) ; port I2C A.4
NetFMU_V5#2_37: FMU_V5#2.37(VCC) ; port CAN2.1
NetFMU_V5#2_38: FMU_V5#2.38(CANH) ; port CAN2.2
NetFMU_V5#2_39: FMU_V5#2.39(CANL) ; port CAN2.3
NetFMU_V5#2_40: FMU_V5#2.40(GND) ; port CAN2.4
NetFMU_V5#2_41: FMU_V5#2.41(-) ; port SBUS OUT.1
NetFMU_V5#2_42: FMU_V5#2.42(SBUS_OUT) ; port SBUS OUT.2
NetFMU_V5#2_43: FMU_V5#2.43(GND) ; port SBUS OUT.3
NetFMU_V5#2_44: FMU_V5#2.44(VCC) ; port PPM RC.1
NetFMU_V5#2_45: FMU_V5#2.45(PPM) ; port PPM RC.2
NetFMU_V5#2_46: FMU_V5#2.46(GND) ; port PPM RC.3
NetFMU_V5#2_47: FMU_V5#2.47(VDD_SERVO) ; port I/O PWM OUT.1
NetFMU_V5#2_48: FMU_V5#2.48(IO_CH1) ; port I/O PWM OUT.2
NetFMU_V5#2_49: FMU_V5#2.49(IO_CH2) ; port I/O PWM OUT.3
NetFMU_V5#2_50: FMU_V5#2.50(IO_CH3) ; port I/O PWM OUT.4
NetFMU_V5#2_51: FMU_V5#2.51(IO_CH4) ; port I/O PWM OUT.5
NetFMU_V5#2_52: FMU_V5#2.52(IO_CH5) ; port I/O PWM OUT.6
NetFMU_V5#2_53: FMU_V5#2.53(IO_CH6) ; port I/O PWM OUT.7
NetFMU_V5#2_54: FMU_V5#2.54(IO_CH7) ; port I/O PWM OUT.8
NetFMU_V5#2_55: FMU_V5#2.55(IO_CH8) ; port I/O PWM OUT.9
NetFMU_V5#2_56: FMU_V5#2.56(GND) ; port I/O PWM OUT.10
NetFMU_V5#2_57: FMU_V5#2.57(VCC) ; port UART & I2C B.1
NetFMU_V5#2_58: FMU_V5#2.58(TX(out)) ; port UART & I2C B.2
NetFMU_V5#2_59: FMU_V5#2.59(RX(in)) ; port UART & I2C B.3
NetFMU_V5#2_60: FMU_V5#2.60(SCL2) ; port UART & I2C B.4
NetFMU_V5#2_61: FMU_V5#2.61(SDA2) ; port UART & I2C B.5
NetFMU_V5#2_62: FMU_V5#2.62(GND) ; port UART & I2C B.6
NetFMU_V5#2_63: FMU_V5#2.63(VDD_5V_SBUS_RC) ; port DSM / SBUS RC.1
NetFMU_V5#2_64: FMU_V5#2.64(SBUS*) ; port DSM / SBUS RC.2
NetFMU_V5#2_65: FMU_V5#2.65(RSSI**) ; port DSM / SBUS RC.3
NetFMU_V5#2_66: FMU_V5#2.66(VDD_3V3_SPEKTRUM) ; port DSM / SBUS RC.4
NetFMU_V5#2_67: FMU_V5#2.67(GND) ; port DSM / SBUS RC.5
NetFMU_V5#2_68: FMU_V5#2.68(VCC) ; port CAP & ADC IN.1
NetFMU_V5#2_69: FMU_V5#2.69(FMU_CAP1) ; port CAP & ADC IN.2
NetFMU_V5#2_70: FMU_V5#2.70(FMU_CAP2) ; port CAP & ADC IN.3
NetFMU_V5#2_71: FMU_V5#2.71(FMU_CAP3) ; port CAP & ADC IN.4
NetFMU_V5#2_72: FMU_V5#2.72(TIM5_SPARE_4) ; port CAP & ADC IN.5
NetFMU_V5#2_73: FMU_V5#2.73(ADC1_SPARE_1) ; port CAP & ADC IN.6
NetFMU_V5#2_74: FMU_V5#2.74(ADC1_SPARE_2) ; port CAP & ADC IN.7
NetFMU_V5#2_75: FMU_V5#2.75(GND) ; port CAP & ADC IN.8
NetFMU_V5#2_76: FMU_V5#2.76(VCC) M8N#2.1(VCC) ; port GPS MODULE.1
NetFMU_V5#2_77: FMU_V5#2.77(TX(out)) M8N#2.2(TX(out)) ; port GPS MODULE.2
NetFMU_V5#2_78: FMU_V5#2.78(RX(in)) M8N#2.3(RX(in)) ; port GPS MODULE.3
NetFMU_V5#2_79: FMU_V5#2.79(SCL1) M8N#2.4(SCL1) ; port GPS MODULE.4
NetFMU_V5#2_80: FMU_V5#2.80(SDA1) M8N#2.5(SDA1) ; port GPS MODULE.5
NetFMU_V5#2_81: FMU_V5#2.81(SAFETY_SWITCH) M8N#2.6(SWITCH) ; port GPS MODULE.6
NetFMU_V5#2_82: FMU_V5#2.82(SAFETY_SWITCH_LED) M8N#2.7(LED) ; port GPS MODULE.7
NetFMU_V5#2_83: FMU_V5#2.83(VDD_3V3) M8N#2.8(VDD_3V3) ; port GPS MODULE.8
NetFMU_V5#2_84: FMU_V5#2.84(BUZZER-) M8N#2.9(BUZZER) ; port GPS MODULE.9
NetFMU_V5#2_85: FMU_V5#2.85(GND) M8N#2.10(GND) ; port GPS MODULE.10
NetFMU_V5#2_86: FMU_V5#2.86(VCC) ; port SPI.1
NetFMU_V5#2_87: FMU_V5#2.87(SCK) ; port SPI.2
NetFMU_V5#2_88: FMU_V5#2.88(MISO) ; port SPI.3
NetFMU_V5#2_89: FMU_V5#2.89(MOSI) ; port SPI.4
NetFMU_V5#2_90: FMU_V5#2.90(CS1) ; port SPI.5
NetFMU_V5#2_91: FMU_V5#2.91(CS2) ; port SPI.6
NetFMU_V5#2_92: FMU_V5#2.92(GND) ; port SPI.7
NetFMU_V5#2_93: FMU_V5#2.93(VDD_SERVO) ; port FMU PWM OUT.1
NetFMU_V5#2_94: FMU_V5#2.94(FMU_CH1) ; port FMU PWM OUT.2
NetFMU_V5#2_95: FMU_V5#2.95(FMU_CH2) ; port FMU PWM OUT.3
NetFMU_V5#2_96: FMU_V5#2.96(FMU_CH3) ; port FMU PWM OUT.4
NetFMU_V5#2_97: FMU_V5#2.97(FMU_CH4) ; port FMU PWM OUT.5
NetFMU_V5#2_98: FMU_V5#2.98(FMU_CH5) ; port FMU PWM OUT.6
NetFMU_V5#2_99: FMU_V5#2.99(FMU_CH6) ; port FMU PWM OUT.7
NetFMU_V5#2_100: FMU_V5#2.100(FMU_CH7) ; port FMU PWM OUT.8
NetFMU_V5#2_101: FMU_V5#2.101(FMU_CH8) ; port FMU PWM OUT.9
NetFMU_V5#2_102: FMU_V5#2.102(GND) ; port FMU PWM OUT.10
NetFMU_V5#2_103: FMU_V5#2.103(VT) ; port FMU DEBUG.1
NetFMU_V5#2_104: FMU_V5#2.104(TX) ; port FMU DEBUG.2
NetFMU_V5#2_105: FMU_V5#2.105(RX) ; port FMU DEBUG.3
NetFMU_V5#2_106: FMU_V5#2.106(SWDIO) ; port FMU DEBUG.4
NetFMU_V5#2_107: FMU_V5#2.107(SWCLK) ; port FMU DEBUG.5
NetFMU_V5#2_108: FMU_V5#2.108(GND) ; port FMU DEBUG.6
NetFMU_V5#2_109: FMU_V5#2.109(VT) ; port I/O DEBUG.1
NetFMU_V5#2_110: FMU_V5#2.110(TX) ; port I/O DEBUG.2
NetFMU_V5#2_111: FMU_V5#2.111(NC) ; port I/O DEBUG.3
NetFMU_V5#2_112: FMU_V5#2.112(SWDIO) ; port I/O DEBUG.4
NetFMU_V5#2_113: FMU_V5#2.113(SWCLK) ; port I/O DEBUG.5
NetFMU_V5#2_114: FMU_V5#2.114(GND) ; port I/O DEBUG.6
NetFMU_V5#2_116: FMU_V5#2.116(I/O_Reset) ; port I/O RESET BUTTON
NetFMU_V5#2_117: FMU_V5#2.117(SD_Card) ; port 32 GB SD CARD
NetFMU_V5#2_118: FMU_V5#2.118(FMU_Reset) ; port FMU RESET BUTTON
NetFront_Range_Finder_1: Front_Range_Finder.1(VDC_5V) ; port FRONT RF.1
NetFront_Range_Finder_2: Front_Range_Finder.2(Power_enable) ; port FRONT RF.2
NetFront_Range_Finder_3: Front_Range_Finder.3(Mode_control) ; port FRONT RF.3
NetFront_Range_Finder_4: Front_Range_Finder.4(SCL) ; port FRONT RF.4
NetFront_Range_Finder_5: Front_Range_Finder.5(SDA) ; port FRONT RF.5
NetFront_Range_Finder_6: Front_Range_Finder.6(GND) ; port FRONT RF.6
NetLeft_1: Left.1(VIN) LGC.5(VOUT)
NetLeft_2: Left.2(SIG) LGC.6(SIG)
NetLeft_3: Left.3(GND) LGC.7(GND)
NetLGC_8: LGC.8(VOUT) Right.1(VIN)
NetLGC_9: LGC.9(SIG) Right.2(SIG)
NetLGC_10: LGC.10(GND) Right.3(GND)
NetXavier_NX_J12_1: Xavier_NX_J12.1(3.3VDC) ; port 2x20.1
NetXavier_NX_J12_2: Xavier_NX_J12.2(5VDC) ; port 2x20.2
NetXavier_NX_J12_3: Xavier_NX_J12.3(I2C1_SDA) ; port 2x20.3
NetXavier_NX_J12_4: Xavier_NX_J12.4(5VDC) ; port 2x20.4
NetXavier_NX_J12_5: Xavier_NX_J12.5(I2C1_SCL) ; port 2x20.5
NetXavier_NX_J12_6: Xavier_NX_J12.6(GND) ; port 2x20.6
NetXavier_NX_J12_7: Xavier_NX_J12.7(GPIO) ; port 2x20.7
NetXavier_NX_J12_8: Xavier_NX_J12.8(UART1_TXD) ; port 2x20.8
NetXavier_NX_J12_9: Xavier_NX_J12.9(GND) ; port 2x20.9
NetXavier_NX_J12_10: Xavier_NX_J12.10(UART1_RXD) ; port 2x20.10
NetXavier_NX_J12_11: Xavier_NX_J12.11(UART1_RTS) ; port 2x20.11
NetXavier_NX_J12_12: Xavier_NX_J12.12(I2S0_SCLK) ; port 2x20.12
NetXavier_NX_J12_13: Xavier_NX_J12.13(SPI1_SCK) ; port 2x20.13
NetXavier_NX_J12_14: Xavier_NX_J12.14(GND) ; port 2x20.14
NetXavier_NX_J12_15: Xavier_NX_J12.15(GPIO) ; port 2x20.15
NetXavier_NX_J12_16: Xavier_NX_J12.16(SPI1_CS1) ; port 2x20.16
NetXavier_NX_J12_17: Xavier_NX_J12.17(3.3VDC) ; port 2x20.17
NetXavier_NX_J12_18: Xavier_NX_J12.18(SPI1_CS0) ; port 2x20.18
NetXavier_NX_J12_19: Xavier_NX_J12.19(SPI0_MOSI) ; port 2x20.19
NetXavier_NX_J12_20: Xavier_NX_J12.20(GND) ; port 2x20.20
NetXavier_NX_J12_21: Xavier_NX_J12.21(SPI0_MISO) ; port 2x20.21
NetXavier_NX_J12_22: Xavier_NX_J12.22(SPI1_MISO) ; port 2x20.22
NetXavier_NX_J12_23: Xavier_NX_J12.23(SPI0_SCK) ; port 2x20.23
NetXavier_NX_J12_24: Xavier_NX_J12.24(SPI0_CS0) ; port 2x20.24
NetXavier_NX_J12_25: Xavier_NX_J12.25(GND) ; port 2x20.25
NetXavier_NX_J12_26: Xavier_NX_J12.26(SPI0_CS1) ; port 2x20.26
NetXavier_NX_J12_27: Xavier_NX_J12.27(I2C0_SDA) ; port 2x20.27
NetXavier_NX_J12_28: Xavier_NX_J12.28(I2C0_CLK) ; port 2x20.28
NetXavier_NX_J12_29: Xavier_NX_J12.29(GPIO) ; port 2x20.29
NetXavier_NX_J12_30: Xavier_NX_J12.30(GND) ; port 2x20.30
NetXavier_NX_J12_31: Xavier_NX_J12.31(GPIO) ; port 2x20.31
NetXavier_NX_J12_32: Xavier_NX_J12.32(PWM) ; port 2x20.32
NetXavier_NX_J12_33: Xavier_NX_J12.33(PWM) ; port 2x20.33
NetXavier_NX_J12_34: Xavier_NX_J12.34(GND) ; port 2x20.34
NetXavier_NX_J12_35: Xavier_NX_J12.35(I2S0_FS) ; port 2x20.35
NetXavier_NX_J12_36: Xavier_NX_J12.36(UART1_CTS) ; port 2x20.36
NetXavier_NX_J12_37: Xavier_NX_J12.37(SPI1_MOSI) ; port 2x20.37
NetXavier_NX_J12_38: Xavier_NX_J12.38(I2S0_DIN) ; port 2x20.38
NetXavier_NX_J12_39: Xavier_NX_J12.39(GND) ; port 2x20.39
NetXavier_NX_J12_40: Xavier_NX_J12.40(I2S0_DOUT) ; port 2x20.40
NetXavier_NX_J14_1: Xavier_NX_J14.1(Power_LED_-) ; port 1x12.1
NetXavier_NX_J14_2: Xavier_NX_J14.2(Power_LED_+) ; port 1x12.2
NetXavier_NX_J14_3: Xavier_NX_J14.3(UART2_RXD) ; port 1x12.3
NetXavier_NX_J14_4: Xavier_NX_J14.4(UART2_TXD) ; port 1x12.4
NetXavier_NX_J14_5: Xavier_NX_J14.5(LATCH_SET) ; port 1x12.5
NetXavier_NX_J14_6: Xavier_NX_J14.6(lATC_BTN) ; port 1x12.6
NetXavier_NX_J14_7: Xavier_NX_J14.7(GND) ; port 1x12.7
NetXavier_NX_J14_8: Xavier_NX_J14.8(SYS_RESET) ; port 1x12.8
NetXavier_NX_J14_9: Xavier_NX_J14.9(GND) ; port 1x12.9
NetXavier_NX_J14_10: Xavier_NX_J14.10(F-RECOVERY) ; port 1x12.10
NetXavier_NX_J14_11: Xavier_NX_J14.11(GND) ; port 1x12.11
NetXavier_NX_J14_12: Xavier_NX_J14.12(POWER_BTN) ; port 1x12.12
(unnamed): port 5V 2.5A, sheet Pegasus PCB/5V 2.5A Output
(unnamed): port FMU DEBUG.Console TX, port FTDI-USB A 3.3V.RXD
(unnamed): port FMU DEBUG.Console RX, port FTDI-USB A 3.3V.TXD
(unnamed): port FMU DEBUG.GND, port FTDI-USB A 3.3V.GND

Not connected (* = marked no-connect by the designer): 1x4#2 1(I_IN) 3(I2) 4(I3) 5(I4); 1x8#2 1(P_IN) 7(P6) 8(P7) 9(P8); 2.4GHz_ACCST 1(SBUS) 2(RSSI) 4(CH1-CH8); 3G/4G 3(40_Pin_Exp_Header); A206 1(_Camera_Conn._1) 4(USB_3.1_2) 5(USB_Micro_B) 8(HDMI_/_DP) 9(Camera_Conn._2) 12(40_Pin_Exp_Header) 13(Fan_Header) 14(Button_Header) 16(Power_Jack) DS1(Power_LED); PM07#2 2(5V_3A_PWR1) 3(5V_3A_PWR2) 4(FMU_PWM-IN) 5(FMU_PWM-OUT) 6(CAP_ADC-IN) 7(CAP_ADC-OUT) 8(I/O_PWM-IN) 9(I/O_PWM-OUT) 16(B+) 17(B+); TC1 1(TELEM)

### Notes on the sheet
- dual 6DBi antennas
- Lens Focal Length - 2.1mm
- (near 3G/4G) dual 7DBi antennas
- Pegasus Drone
- Pegasus Drone Schematic
- pegasus.mihr.io <http://pegasus.mihr.io>
- 1
- 2
- V2
- Mihir Patel

### Library data of the parts
1x4#2 = CMP-00028-00024-3: Holybro I2C Splitter
1x8#2 = CMP-00028-00022-4: Holybro PWM Splitter
2.4GHz_ACCST = CMP-00028-00023-1: FrSky 2.4GHz ACCST
3G/4G = CMP-00028-00027-5: Sixfab LTE Module
5000mAh_6S_45C = CMP-00029-00000-1: as 3S_3000_mAh_45C on sheet Medusa; RoHS Compliant: NotApplicable; Mounting Technology: WithLeads; Pins: 2
A206 = CMP-00028-00029-2: A206
Bottom_Range_Finder Front_Range_Finder = CMP-00028-00011-7: Garmin Lidar
ESC_1#2 ESC_2#2 ESC_3#2 ESC_4#2 = CMP-00028-00016-7: T-Motor ESC 600 Hz
FMU_V5#2 = CMP-00028-00018-8: FMU V5
Left Right = CMP-00028-00019-3: Tarot 650 Landing Gear Servo Motor
LGC = CMP-00028-00020-2: Tarot 650 LG Controller
M8N#2 = CMP-00028-00021-1: Pixhawk 4 GPS Module
Motor_1#2 Motor_2#2 Motor_3#2 Motor_4#2 = CMP-00028-00017-4: KV400
PM07#2 = CMP-00028-00007-5: Holybro Power Module
TC1 = CMP-00028-00026-1: FrSky Yappu Telemetry Converter Cable
Xavier_NX_J12 = CMP-00028-00030-3: Xavier NX Header
Xavier_NX_J14 = CMP-00028-00031-2: Xavier 12 pin J12 Button Header
Zed_2i_with_Polarizer = CMP-00028-00028-2: Zed 2i

## Sheet Bellerophon.SchDoc
size A4; SheetNumber: 3; SheetTotal: 3
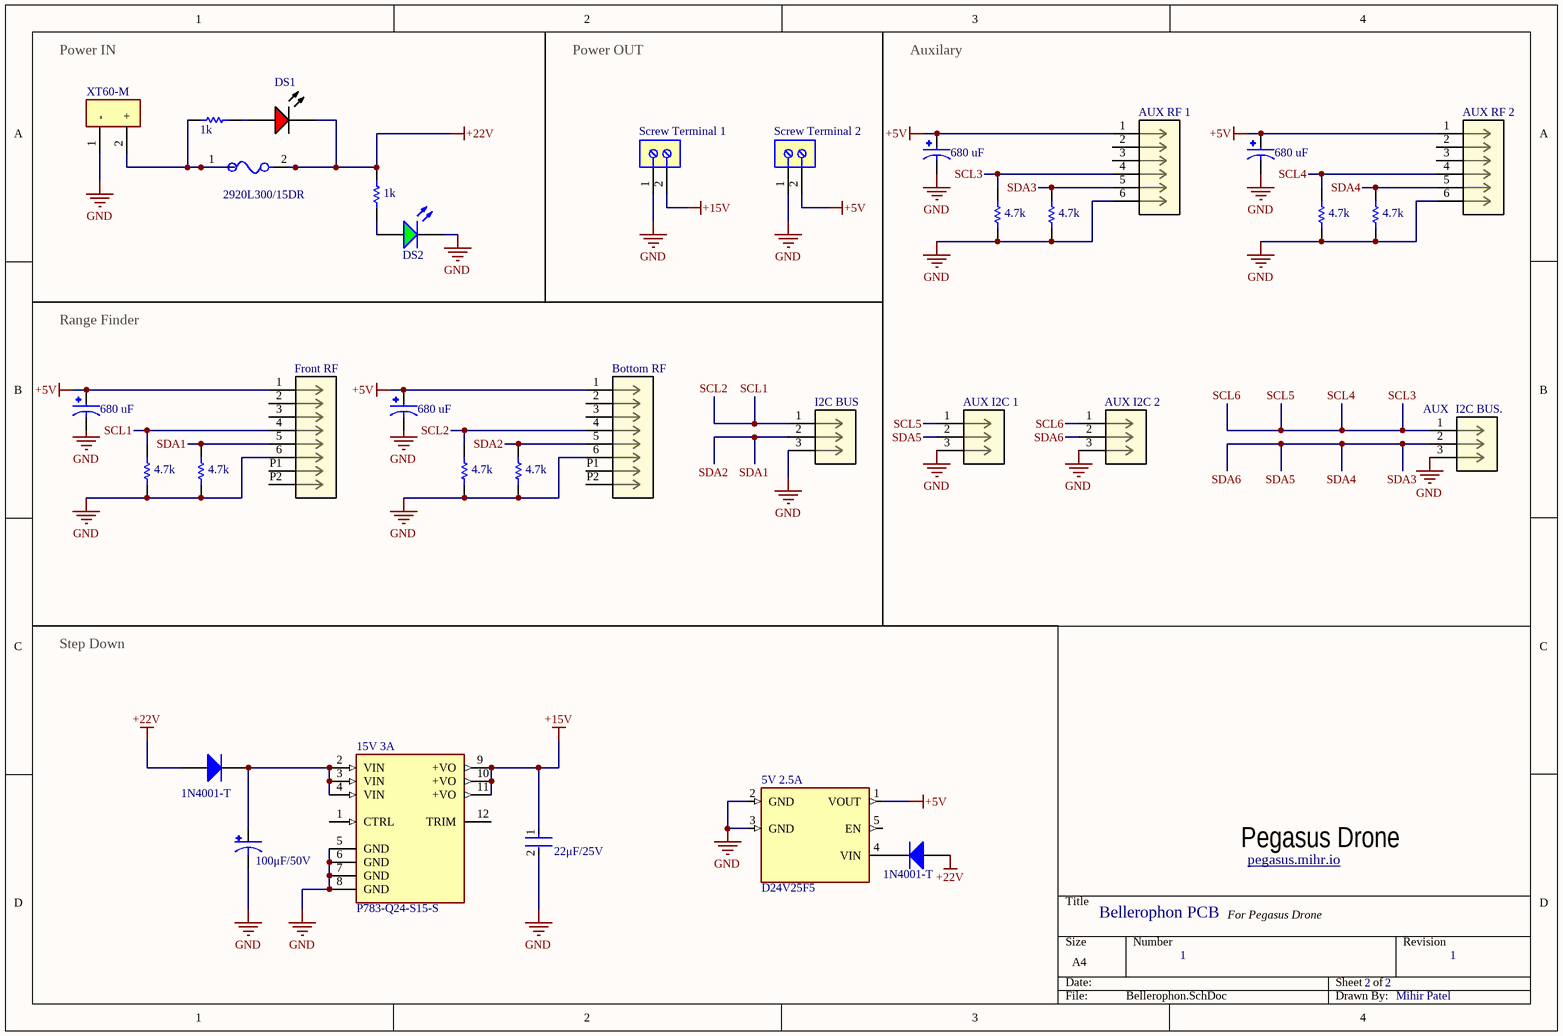
[diagram p2: Bellerophon.SchDoc]

### Parts
5V_2.5A  D24V25F5  [XDCR_12V_2.2A_STEP-DOWN_D24V22F12]
15V_3A  P783-Q24-S15-S  [CONV_P783-Q24-S15-S]
+5VDC  Screw Terminal 2  [PHOE-1725656-2]
+15VDC  Screw Terminal 1  [PHOE-1725656-2]
AUX_I2C_1  1053131303  [CON_1053131303]  (value not drawn)
AUX_I2C_2  1053131303  [CON_1053131303]  (value not drawn)
AUX_RF_1  1053131306  [CON_1053131306]  (value not drawn)
AUX_RF_2  1053131306  [CON_1053131306]  (value not drawn)
Bottom_RF  1053111306  [CON_1053111306_MOL]  (value not drawn)
C1  100μF/50V  [CAPAE830X1020N]
C2  22μF/25V  [FP-1210-L_3_3_0_4-W_2_5_0-MFG]
C3  680 uF  [CAP_EEEFN0J681V]
C4  680 uF  [CAP_EEEFN0J681V]
C5  680 uF  [CAP_EEEFN0J681V]
C6  680 uF  [CAP_EEEFN0J681V]
D1  1N4001-T  [DIOD-DO-41-P-2_V]
D2  1N4001-T  [DIOD-DO-41-P-2_V]
DS1  SML-LX1206IC-TR  [LUMX-SML-LX1206IC_V]  (value not drawn)
DS2  SML-LX1206GC-TR  [LUMX-SML-LX1206GC-TR_V]  (value not drawn)
F1  2920L300/15DR  [FP-2920L-MFG]
Front_RF  1053111306  [CON_1053111306_MOL]  (value not drawn)
I2C_BUS  1053091303  [CON_1053091303]  (value not drawn)
I2C_BUS.  1053131303  [CON_1053131303]  (value not drawn)
R1  1k  [RESC3225X70X50NL20T20]
R2  1k  [RESC3225X70X50NL20T20]
R3  4.7k  [RESC3225X70X50NL20T20]
R4  4.7k  [RESC3225X70X50NL20T20]
R5  4.7k  [RESC3225X70X50NL20T20]
R6  4.7k  [RESC3225X70X50NL20T20]
R7  4.7k  [RESC3225X70X50NL20T20]
R8  4.7k  [RESC3225X70X50NL20T20]
R9  4.7k  [RESC3225X70X50NL20T20]
R10  4.7k  [RESC3225X70X50NL20T20]
VIN  XT60-M  [AMASS_XT60-M]

### Blocks framed on the sheet
Power IN: DS1 DS2 F1 R1 R2 VIN
Power OUT: +5VDC +15VDC
Auxilary: AUX_I2C_1 AUX_I2C_2 AUX_RF_1 AUX_RF_2 C5 C6 I2C_BUS. R7-R10
Range Finder: Bottom_RF C3 C4 Front_RF I2C_BUS R3-R6
Step Down: 5V_2.5A 15V_3A C1 C2 D1 D2

### Nets
+5V: 5V_2.5A.1(VOUT) +5VDC.2 AUX_RF_1.1 AUX_RF_2.1 Bottom_RF.1 C3.1 C4.1 C5.1 C6.1 Front_RF.1
+15V: 15V_3A.9(+VO) 15V_3A.10(+VO) 15V_3A.11(+VO) +15VDC.2 C2.1
+22V: D1.1(A) D2.1(A) DS1.2(K) F1.2 R2.1
GND: 5V_2.5A.2(GND) 5V_2.5A.3(GND) 15V_3A.5(GND) 15V_3A.6(GND) 15V_3A.7(GND) 15V_3A.8(GND) +5VDC.1 +15VDC.1 AUX_I2C_1.3 AUX_I2C_2.3 AUX_RF_1.6 AUX_RF_2.6 Bottom_RF.6 C1.2(NEG) C2.2 C5.2 C6.2 DS2.2(K) Front_RF.6 I2C_BUS.3 I2C_BUS..3 R3.2 R4.2 R5.2 R6.2 R7.2 R8.2 R9.2 R10.2 VIN.1(-)
SCL1: Bottom_RF.4 Front_RF.4 I2C_BUS.1 R4.1 R6.1  [also labelled SCL2]
SCL3: AUX_I2C_1.1 AUX_I2C_2.1 AUX_RF_1.4 AUX_RF_2.4 I2C_BUS..1 R8.1 R10.1  [also labelled SCL4, SCL5, SCL6]
SDA1: Bottom_RF.5 Front_RF.5 I2C_BUS.2 R3.1 R5.1  [also labelled SDA2]
SDA3: AUX_I2C_1.2 AUX_I2C_2.2 AUX_RF_1.5 AUX_RF_2.5 I2C_BUS..2 R7.1 R9.1  [also labelled SDA4, SDA5, SDA6]
Net5V_2.5A_4: 5V_2.5A.4(VIN) D2.2(K)
Net15V_3A_2: 15V_3A.2(VIN) 15V_3A.3(VIN) 15V_3A.4(VIN) C1.1(POS) D1.2(K)
NetDS1_1: DS1.1(A) R1.2
NetDS2_1: DS2.1(A) R2.2
NetF1_1: F1.1 R1.1 VIN.2(+)

Not connected (* = marked no-connect by the designer): 5V_2.5A 5(EN) 6(GND); 15V_3A 1(CTRL) 12(TRIM); AUX_RF_1 2 3; AUX_RF_2 2 3; Bottom_RF 2 3 P1 P2; C3 2; C4 2; Front_RF 2 3 P1 P2

### Notes on the sheet
- (near I2C_BUS.) AUX
- Pegasus Drone
- Bellerophon PCB
- For Pegasus Drone
- pegasus.mihr.io <http://pegasus.mihr.io>
- 1
- 2
- Mihir Patel
- Labels drawn without touching a wire or pin: GND

### Library data of the parts
5V_2.5A = 12V_2.2A_STEP-DOWN_D24V22F12: Converter: step down; Uin: 12.7Ã·36V; Uout: 12V; 2200mA; 90Ã·95%; MP: 12V 2.2A STEP-DOWN D24V22F12; MF: Pololu; Price: None; Availability: Unavailable; SnapEDA_Link: https://www.snapeda.com/parts/12V%202.2A%20STEP-DOWN%20D24V22F12/Pololu/view-part/1771637/?ref=snap; Value: *; Package: None
+5VDC +15VDC = CMP-2000-05299-1: Male Header, Pitch 2.54 mm, 1 x 2 Position, Height 9 mm, Tail Length 3.5 mm; Manufacturer part No.: 1725656; Manufacturer: Phoenix Contact; Number of contacts: 2; Content: 250pc(s); Pitch: 2.54mm; Industrial packaging: Yes; Colour: Green; Type: MPT0,5/2-2,54; Datasheet URL: http://datasheet.octopart.com/1725656-Phoenix-Contact-datasheet-5302866.pdf; Manufacturer URL: http://www.phoenixcontact.com/; Datasheet Version: Apr-08
AUX_I2C_1 AUX_I2C_2 I2C_BUS. = 1053131303: No Description Available; Mfr_Name: Molex Connector Corporation; Copyright: Copyright (C) 2022 Ultra Librarian. All rights reserved.; Manufacturer_Part_Number: 1053131303; Digi-Key_Part_Number_1: WM15142-ND; RefDes: RefDes; Type: DEV
AUX_RF_1 AUX_RF_2 = 1053131306: No Description Available; Mfr_Name: Molex Connector Corporation; Copyright: Copyright (C) 2022 Ultra Librarian. All rights reserved.; Manufacturer_Part_Number: 1053131306; Digi-Key_Part_Number_1: WM15145-ND; RefDes: RefDes; Type: DEV
Bottom_RF Front_RF = 1053111306: No Description Available; Mfr_Name: Molex Connector Corporation; Copyright: Copyright (C) 2022 Ultra Librarian. All rights reserved.; Manufacturer_Part_Number: 1053111306; Digi-Key_Part_Number_1: WM15093-ND; RefDes: RefDes; Type: DEV
C1 = EDK107M050A9MAA: 100ÂµF 50V Aluminum Electrolytic Capacitors Radial, Can - SMD 2000 Hrs @ 85Â°C; MF: KEMET; Value: *; SnapEDA_Link: https://www.snapeda.com/parts/EDK107M050A9MAA/KEMET/view-part/285947/?ref=snap; Price: None; Availability: Unavailable; Package: Radial Kemet; MP: EDK107M050A9MAA
C2 = CMP-2000-05483-2: General Purpose Ceramic Capacitor, 1210, 22uF, 10%, X5R, 15%, 16V; Tolerance: 10%; Width: 0.098inch; Length: 3.2mm; Min Operating Temperature: -55°C; Capacitance: 22uF; Case/Package: 1210; Termination: SMD/SMT; Voltage: 16V; Number of Pins: 2; Thickness: 0.11inch; Height: 2.79mm; Weight: 0.000564oz; Case Code (Imperial): 1210; Contact Plating: Tin; Lead Free: Lead Free; RoHS Compliant: Yes; Packaging: Tape and Reel; Package Quantity: 1; Construction: Flat; Series: -; REACH SVHC: No SVHC; Case Code (Metric): 3225; Size: 2.79mm; Radiation Hardening: No; Voltage Rating: 16V; Depth: 2.5mm; Mount: Surface Mount; Voltage Rating (DC): 16V; Dielectric: X5R; Max Operating Temperature: 85°C
C3-C6 = EEEFN0J681V: CAP ALUM 680UF 20% 6.3V SMD; MF: Panasonic; MP: EEEFN0J681V; Check_prices: https://www.snapeda.com/parts/EEEFN0J681V/Panasonic/view-part/?ref=eda; Package: RADIAL-2 Panasonic; SnapEDA_Link: https://www.snapeda.com/parts/EEEFN0J681V/Panasonic/view-part/?ref=snap; Value: *; Price: None; Purchase-URL: https://pricing.snapeda.com/search/part/EEEFN0J681V/?ref=eda; Availability: In Stock
D1 D2 = CMP-0639-00006-2: 1.0 A Rectifier, 15 pF, 50 V, -65 to 150 degC, 2-Pin DO-41 Plastic, RoHS, Tape and Reel; Manufacturer: Diodes Inc; VF (V): 1; CT (pF): 15; Max. IR (uA): 5; VRRM (V): 50; Max. IFSM (A): 30; RoHS: TRUE; Mounting Technology: Through Hole; PartNumber: 1N4001-T; ComponentLink2Description: Datasheet; DatasheetVersion: Rev. 8-2; Operating Temperature Range (degC): -65 to 150; Packing: Tape and Reel; PackageReference: DO-41-P-2; ComponentLink1URL: http://diodes.com/; PackageDescription: 2-Pin Axial Lead, Body 4.635 x 2.36 mm, Lead Spread 25.4 mm; ComponentLink2URL: http://diodes.com/datasheets/ds28002.pdf; Max. Average Rectified Current IO (A): 1; ComponentLink1Description: Manufacturer URL
DS1 = CMP-2000-07123-1: LED Red, 65 mW, -40 to 85 degC, 2-Pin SMD, RoHS, Tape and Reel; Manufacturer: Lumex; LED Material: GaAsP; Peak Wavelength: 635nm; Number of LEDs: 1; Viewing Angle: 160; Reverse Voltage: 5(Min)V; Lens Appearance: ColorlessNonDiffused; Intensity: 6mcd; Type: Uni-Color; Pin_Count: 2; Lens Dimensions: 2x1.6x0.5mm; Mounting: SurfaceMount; ECCN: EAR99; RoHS: Unknown; Package Description: 2-Pin Surface Mount Device, Body 3.2 x 1.5 mm; Mounting Technology: SurfaceMount; Dominant Wavelength: N/A; Supplier_Package: SMD; Supplier Standard Pack: 3,000; Color: Red; Dimension: 3.2x1.6x1.1mm; HTS: 8541402000; Part No: SML-LX1206IC-TR; Family: SML-LX1206IC; Supplier: Lumex; Datasheet URL: http://www.lumex.com/content/files/ProductAttachment/SML-LX1206IC-TR.pdf; Package Reference: SML-LX1206IC; Manufacturer URL: http://www.lumexinstruments.com/; Operating Temperature: -25to85C; Packaging: TapeandReel; Datasheet Version: Rev. J, 08/2012
DS2 = CMP-2000-07122-1: Green Led, Water Clear Lens, 10 mcd, 565 nm, 2.2 V, -40 to 85 degC, 2-Pin SMD, RoHS, Tape and Reel; Manufacturer: Lumex; Number of LEDs: 1; Type: Uni-Color; Viewing Angle: 160; Pin_Count: 2; Intensity: 10mcd; Reverse Voltage: 5(Min)V; COO: CN; LED Material: GaP; Peak Wavelength: 565nm; Lens Appearance: ColorlessNonDiffused; Datasheet Version: Rev. J, 04/2011; Package Description: 2-Pin Surface Mount Device, Body 3.2 x 1.6 mm; Part No: SML-LX1206GC-TR; Lens Dimensions: 2x1.6x0.5mm; Dimension: 3.2x1.6x1.1mm; Color: Green; Supplier: Lumex; Supplier Standard Pack: 3,000; Manufacturer URL: http://www.lumexinstruments.com/; Dominant Wavelength: N/A; ECCN: EAR99; Datasheet URL: http://www.mouser.com/ds/2/244/SML-LX1206GC-TR-112732.pdf; HTS: 8541402000; Mounting: SurfaceMount; Package Reference: SML-LX1206GC-TR; Family: SML-LX1206GC; Packaging: TapeandReel; RoHS: Yes; Operating Temperature: -40to85C; Supplier_Package: SMD; Mounting Technology: SurfaceMount
F1 = CMP-2000-05550-2: PTC RESET FUSE 15V 3A 2920; Manufacturer: Littelfuse; Current Rating: 40A; Trip Current: 5A; Trip Time: 20s; Resistance: 0.015-0.048Ω; Value: 0.015-0.048Ω; Device Class L3: unset; Temperature: -40°C to +85°C; ComponentLink2Description: Datasheet; Temperature Range High: +85°C; Digikey Description: PTC RESET FUSE 15V 3A 2920; Lead Free: Yes; Height: 1.25mm; Voltage Rating: 15V; Package: 2920L; Temperature Range Low: -40°C; Ambient Temperature Range High: +85°C; RoHS: TRUE; Ambient Temperature Range Low: -40°C; Device Class L2: PTC Resettable Fuses; Category: Fuse; Automotive: No; ComponentLink2URL: https://m.littelfuse.com/~/media/electronics/datasheets/resettable_ptcs/littelfuse_ptc_2920l_datasheet.pdf.pdf; Device Class L1: Circuit Protection; Hold Current: 3A; Manufacturer Part Number: 2920L300/15DR; Octopart: https://octopart.com/2920l300%2F15dr-littelfuse-673797
I2C_BUS = 1053091303: No Description Available; Mfr_Name: Molex Connector Corporation; Copyright: Copyright (C) 2022 Ultra Librarian. All rights reserved.; Manufacturer_Part_Number: 1053091303; Digi-Key_Part_Number_1: WM15037-ND; RefDes: RefDes; Type: DEV
R1-R10 = CMP-2005-03583-1: Part Number: ERJ-14YJ472U; Manufacturer: Panasonic
VIN = XT60-M: Plug; DC supply; XT60; male; PIN: 2; for cable; soldered; 30A; 500V; MF: AMASS; MP: XT60-M; Price: None; Package: Package Analog Devices; Value: *; Availability: Unavailable; SnapEDA_Link: https://www.snapeda.com/parts/XT60-M/AMASS/view-part/2883912/?ref=snap
15V_3A = P783-Q24-S15-S: Package: None; Price: None; Value: *; MP: P783-Q24-S15-S; Availability: Unavailable

## Nets that join several sheets
GND: Medusa (11 pins), Pegasus (13 pins), Bellerophon (30 pins)